# EAGLE design l6727a-5v (EAGLE 7.3.0)
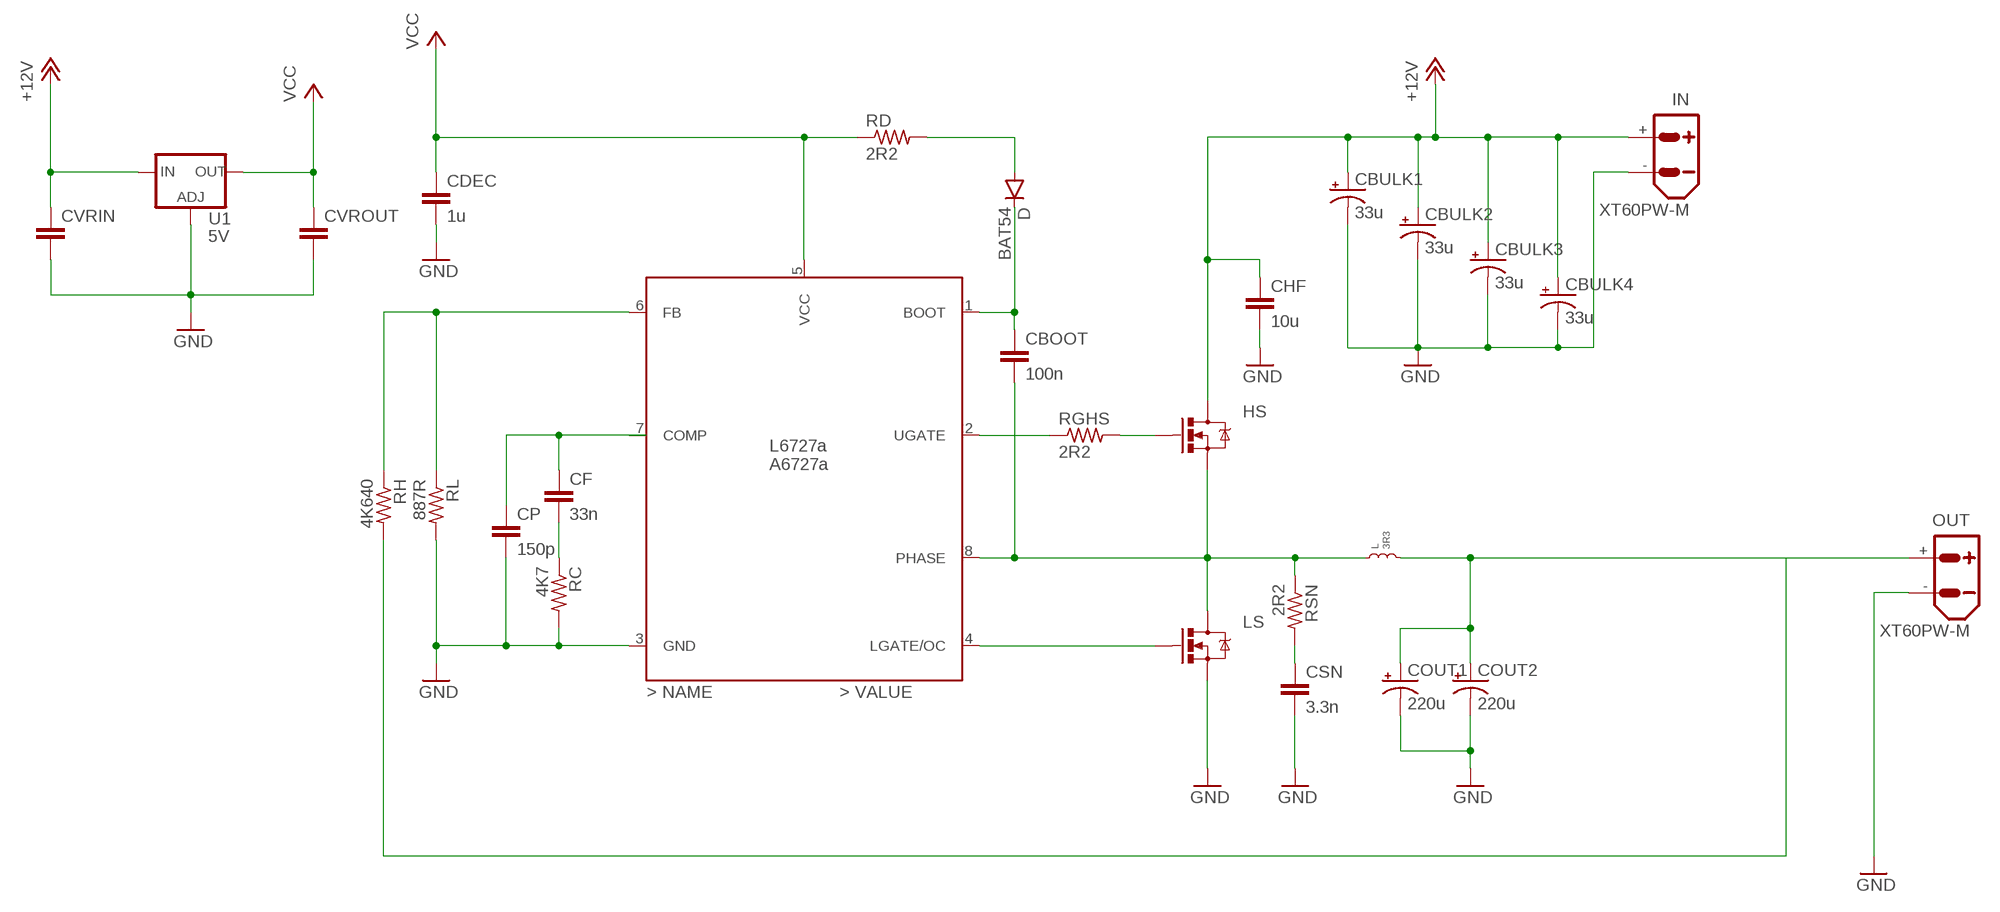
[diagram p0: schematic, sheet 1]

## Parts
CBOOT  100n  C-EUC0603  [C0603]
CBULK1  33u  CPOL-USSANYO_SMD_E7  [SANYO-OSCON_SMD_E7]
CBULK2  33u  CPOL-USSANYO_SMD_E7  [SANYO-OSCON_SMD_E7]
CBULK3  33u  CPOL-USSANYO_SMD_E7  [SANYO-OSCON_SMD_E7]
CBULK4  33u  CPOL-USSANYO_SMD_E7  [SANYO-OSCON_SMD_E7]
CDEC  1u  C-EUC0603  [C0603]
CF  33n  C-EUC0603  [C0603]
CHF  10u  C-EUC1206  [C1206]
COUT1  220u  CPOL-USSANYO_SMD_E7  [SANYO-OSCON_SMD_E7]
COUT2  220u  CPOL-USSANYO_SMD_E7  [SANYO-OSCON_SMD_E7]
CP  150p  C-EUC0603  [C0603]
CSN  3.3n  C-EUC0603  [C0603]
CVRIN  C-EUC1206  [C1206]
CVROUT  C-EUC1206  [C1206]
D  BAT54  DIODESOD123  [SOD-123]
HS  MOSFET-NCHANNELFDS6630A  [SO08]
IC1  L6727A  [SO-08]
IN  XT60PW-M  [XT60PW-M]
L  3R3  INDUCTOR.XAL1010  [XAL1010]
LS  MOSFET-NCHANNELFDS6630A  [SO08]
OUT  XT60PW-M  [XT60PW-M]
RC  4K7  R-US_R0603  [R0603]
RD  2R2  R-US_R0603  [R0603]
RGHS  2R2  R-US_R0603  [R0603]
RH  4K640  R-US_R0603  [R0603]
RL  887R  R-US_R0603  [R0603]
RSN  2R2  R-US_R0603  [R0603]
U1  5V  V_REG_317SMD  [SOT223]

## Nets
+12V: CBULK1.+ CBULK2.+ CBULK3.+ CBULK4.+ CHF.1 CVRIN.1 HS.5(D) HS.6(D) HS.7(D) HS.8(D) IN.+ U1.3(IN)
BOOT: CBOOT.1 D.C IC1.1(BOOT)
COMP: CF.1 CP.1
FB: IC1.6(FB) RH.1 RL.1
GND: CBULK1.- CBULK2.- CBULK3.- CBULK4.- CDEC.2 CHF.2 COUT1.- COUT2.- CP.2 CSN.2 CVRIN.2 CVROUT.2 IC1.3(GND) IN.- LS.1(S) LS.2(S) LS.3(S) OUT.- RC.2 RL.2 U1.1(ADJ)
LGATE: IC1.4(LGATE/OC) LS.4(G)
N$1: D.A RD.2
N$3: CF.2 RC.1
PHASE: CBOOT.2 HS.1(S) HS.2(S) HS.3(S) IC1.8(PHASE) L.P$1 LS.5(D) LS.6(D) LS.7(D) LS.8(D) RSN.1
RSN: CSN.1 RSN.2
UGATE: HS.4(G) RGHS.2
UGATE`: IC1.2(UGATE) RGHS.1
VCC: CDEC.1 CVROUT.1 IC1.5(VCC) RD.1 U1.2(OUT)
VOUT: COUT1.+ COUT2.+ L.P$2 OUT.+ RH.2
Unconnected: IC1.7(COMP)

## Library data of the parts
CBOOT CDEC CF CHF CP CSN CVRIN CVROUT = rcl:C-EU: CAPACITOR, European symbol
CBULK1-CBULK4 COUT1 COUT2 = rcl:CPOL-US: POLARIZED CAPACITOR, American symbol
D = SparkFun-DiscreteSemi:DIODE: Diode These are standard reverse protection diodes and small signal diodes. SMA package can handle up to about 1A. SOD-323 can handle about 200mA. What the SOD-323 package when ordering, there are some mfgs out there that are 5-pin packages.
HS LS = SparkFun-DiscreteSemi:MOSFET-NCHANNEL: Common NMOSFET Parts MFG P/N Store ID Prod ID FDD8780 TRANS-09984 SI7820DN TRANS-11055 FDS6630A IC-08089 2N7002PW TRANS-11151 FQP30N06L COM-10213 TRANS-10060 BSS123LT1G TRANS-08345 BSS138 TRANS-00830 BS170 2N7000; PROD_ID: IC-08089
IC1 = stm-l6727a:L6727A: L6726A is a single-phase step-down controller with integrated high-current drivers that provides complete control logic, protections and reference voltage to realize in an easy and simple way general DC-DC converters by using a compact SO-8 package. Device flexibility allows managing conversions with power input VIN as low as 1.5 V and device supply voltage ranging from 5 V to 12 V
IN OUT = amass:XT60: AMASS XT60 connector Store in Japan AMASS XT60 connector <https://szc.jp/ams-xt60>
L = coilcraft:INDUCTOR
RC RD RGHS RH RL RSN = rcl:R-US_: RESISTOR, American symbol
U1 = SparkFun-PowerIC:V_REG_317: Voltage Regulator Standard LM317 adjustable voltage regulator. AOI (Adjust Output Input). Google 'LM317 Calculator' for easy to use app to get the two resistor values needed. 240/720 for 5V output. 240/390 for 3.3V output. Spark Fun Electronics SKU : COM-00527

## Board
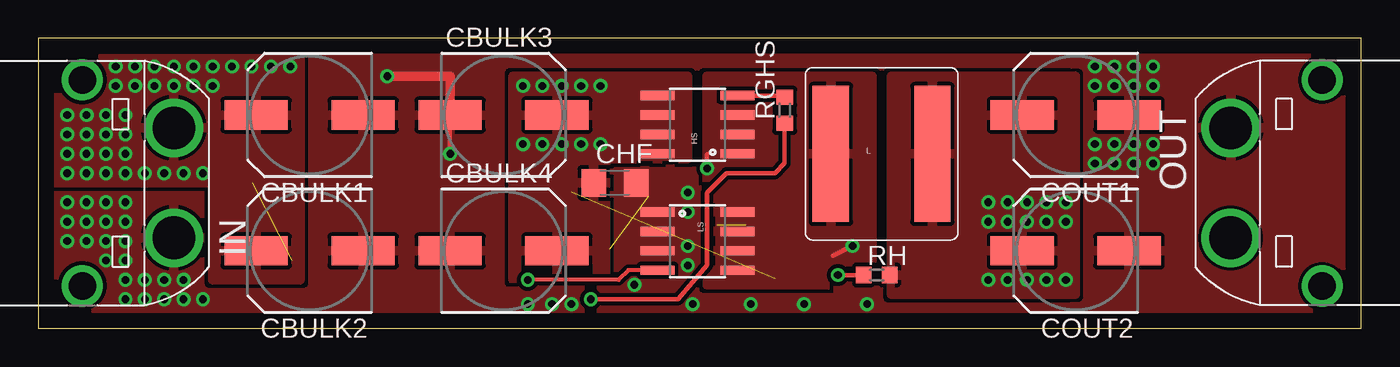
[diagram p1: board, top side]
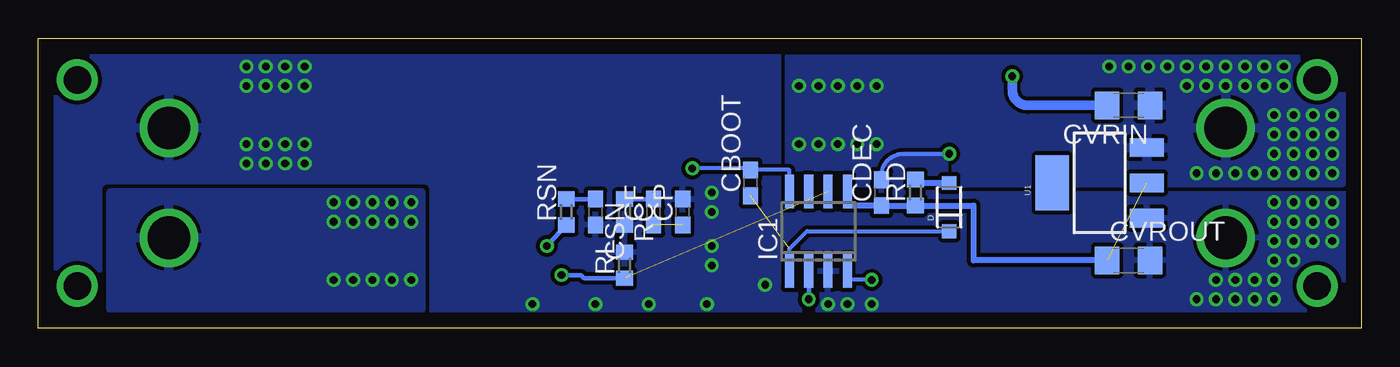
[diagram p2: board, bottom side, seen from below]

Size 86.67 x 19 mm. Coordinates in mm from the lower left corner, seen from the top.
Outline: 0,0 86.67,0 86.67,19 0,19 0,0
Copper layers (1*16): Top 0.035mm / dielectric 1.5mm / Bottom 0.035mm
Design rules "default": minimum track width 10mil, minimum drill 24mil, track to track 8mil, track to pad 8mil, pad to pad 8mil, via to via 8mil, smd to smd 8mil, copper to edge 40mil, drill to drill 8mil, minimum pad ring 10mil, minimum via ring 8mil, stop-mask expansion 4mil, vias tented up to drill 0mil, thermal gap 10mil

### Footprints (pad centres in the part's own frame; a part is rotated, then mirrored left to right if it is on the bottom)
C0603 = smd 1.1 x 1: 1 -0.85,0; 2 0.85,0
SANYO-OSCON_SMD_E7 = smd 4.15 x 1.9: + 3.5,0; - -3.5,0
C1206 = smd 1.6 x 1.8: 1 -1.4,0; 2 1.4,0
SOD-123 = smd 0.9 x 0.95: A 1.575,0; C -1.575,0
SO08 = smd 0.61 x 2.21: 1 -1.905,-2.616; 2 -0.635,-2.616; 3 0.635,-2.616; 4 1.905,-2.616; 5 1.905,2.616; 6 0.635,2.616; 7 -0.635,2.616; 8 -1.905,2.616
SO-08 = smd 0.6 x 2.2: 1 -1.905,-2.6; 2 -0.635,-2.6; 3 0.635,-2.6; 4 1.905,-2.6; 5 1.905,2.6; 6 0.635,2.6; 7 -0.635,2.6; 8 -1.905,2.6
XT60PW-M = drill 2.8: + 3.6,0; - -3.6,0 | drill 1.8: P$3 -6.75,6; P$4 6.75,6
XAL1010 = smd 2.38 x 8.91: P$1 -3.325,0; P$2 3.325,0
R0603 = smd 1 x 1.1: 1 -0.85,0; 2 0.85,0
SOT223 = smd 1.219 x 2.235: 1 -2.311,-3.099; 2 0,-3.099; 3 2.311,-3.099 | smd 3.6 x 2.2: 4 0,3.099

### Placement (x,y rotation side)
CBOOT  40.01,9.53 90 bottom
CBULK1  17.78,13.97 180 top
CBULK2  17.78,5.08 180 top
CBULK3  30.48,13.97 0 top
CBULK4  30.48,5.08 0 top
CDEC  31.43,8.89 90 bottom
CF  46.35,7.62 90 bottom
CHF  37.78,9.53 0 top
COUT1  67.94,13.97 180 top
COUT2  67.94,5.08 180 top
CP  44.45,7.62 90 bottom
CSN  50.16,7.62 270 bottom
CVRIN  15.24,14.61 180 bottom
CVROUT  15.24,4.45 0 bottom
D  26.99,7.94 90 bottom
HS  43.18,13.34 90 top
IC1  35.56,6.35 0 bottom
IN  8.89,9.53 90 top
L  55.24,11.43 0 top
LS  43.18,5.71 270 top
OUT  78.11,9.53 270 top
RC  48.26,7.62 270 bottom
RD  29.21,8.89 90 bottom
RGHS  48.9,14.29 90 top
RH  54.93,3.49 0 top
RL  48.26,4.13 90 bottom
RSN  52.07,7.62 90 bottom
U1  17.14,9.53 90 bottom

### Tracks (layer width: path | path; a pad name or v marks a point on that pad's centre or on a via)
+12V  (via drill 0.5)
  other vias: 31.75,12.06 33.02,12.06 34.29,12.06 35.56,12.06 36.83,12.06 31.75,15.88 33.02,15.88 34.29,15.88 35.56,15.88 36.83,15.88 16.51,17.14 15.24,17.14 13.97,17.14 12.7,17.14 11.43,17.14 10.16,17.14 8.89,17.14 7.62,17.14 6.35,17.14 5.08,17.14 5.08,15.88 6.35,15.88 7.62,15.88 8.89,15.88 10.16,15.88 11.43,15.88 1.91,13.97 3.17,13.97 4.45,13.97 5.71,13.97 5.71,12.7 4.45,12.7 3.17,12.7 1.91,12.7 1.91,11.43 1.91,10.16 3.17,10.16 4.45,10.16 5.71,10.16 5.71,11.43 4.45,11.43 3.17,11.43 6.99,10.16 8.26,10.16 9.53,10.16 10.79,10.16
  pour Top (isolate 0.254, rank 4): 0.64,17.78 17.14,17.78 17.14,3.17 11.43,3.17 11.43,9.53 0.64,9.53
  pour Top (isolate 0.254, rank 4): 31.11,16.51 37.15,16.51 37.15,3.17 31.11,3.17
  pour Bottom (isolate 0.254, rank 4): 1.27,17.78 37.47,17.78 37.47,9.53 1.27,9.53
  pour Top (isolate 0.254, rank 4): 31.11,16.51 42.55,16.51 42.55,11.11 37.15,11.11 37.15,10.16 31.11,10.16
  pour Top (isolate 0.254, rank 5, no thermals): 38.73,15.88 38.73,11.11 42.55,11.11 42.55,15.88
BOOT  (1 unrouted)
  Bottom 0.254: IC1.1 37.47,5.21 36.31,6.36 D.C
COMP  (1 unrouted)
FB  (via drill 0.5)  (1 unrouted)
  Top 0.305: RH.1 v52.39,3.49
  Bottom 0.305: v52.39,3.49 51.12,3.49 50.9,3.28 RL.1
GND  (via drill 0.5)
  Top 0.254: v26.99,11.43 CBULK3.-
  Top 0.61: v22.86,16.51 26.98,16.51 CBULK3.-
  Bottom 0.254: CDEC.2 31.43,10.01 arc90 30.01,11.43 v26.99,11.43
  Bottom 0.61: CVRIN.2 21.86,14.61 arc90 22.86,15.61 v22.86,16.51
  other vias: 69.22,17.14 69.22,15.88 69.22,12.06 69.22,10.79 70.48,10.79 71.75,10.79 73.03,10.79 73.03,12.06 71.75,12.06 70.48,12.06 70.48,15.88 70.48,17.14 71.75,17.14 71.75,15.88 73.03,15.88 73.03,17.14 1.91,8.26 1.91,6.99 1.91,5.71 3.17,5.71 3.17,6.99 3.17,8.26 4.45,8.26 4.45,6.99 4.45,5.71 4.45,4.45 5.71,5.71 5.71,6.99 5.71,8.26 5.71,4.45 5.71,3.17 5.71,1.91 6.99,1.91 6.99,3.17 8.26,3.17 8.26,1.91 9.53,1.91 9.53,3.17 10.79,1.91 32.07,1.59 33.66,1.59 34.92,1.59 39.05,2.86 42.86,1.59 46.67,1.59 50.16,1.59 54.29,1.59 42.55,8.89 42.55,7.62 42.55,5.4 42.55,4.13
  pour Top (rank 5): 67.94,17.78 85.72,17.78 85.72,1.27 67.94,1.27
  pour Bottom (rank 5): 61.59,17.78 81.92,17.78 81.92,10.16 61.59,10.16
  pour Top (isolate 0.254, rank 5): 0,0 30.48,0 30.48,19.05 17.78,19.05 17.78,8.89 0,8.89
  pour Bottom (isolate 0.254, rank 6): 0,19.05 87,19.05 87,0 0,0
  pour Top (isolate 0.254, rank 6): 0,19.05 87,19.05 87,0 0,0
  pour Top (isolate 0.254, rank 5, no thermals): 38.1,10.48 38.1,2.22 43.18,2.22 43.18,10.48
LGATE  (via drill 0.5)
  Top 0.254: v32.07,3.17 38.02,3.17 38.66,3.81 LS.4
  Bottom 0.254: v32.07,3.17 33.66,3.17 IC1.4
N$1
  Bottom 0.406: D.A 29.21,9.51 RD.2
N$3
  Bottom 0.305: CF.2 RC.1
PHASE  (via drill 0.5)
  Top 0.254: v43.81,10.48 43.81,11.43
  Top 0.305: v53.34,5.4 52.07,4.76
  Bottom 0.254: IC1.8 37.47,10.38 CBOOT.2 40.01,10.48 v43.81,10.48
  Bottom 0.305: RSN.1 v53.34,5.4
  pour Top (isolate 0.254, rank 4): 43.81,16.51 54.61,16.51 54.61,2.86 43.81,2.86
  pour Top (isolate 0.254, rank 5, no thermals): 43.81,14.61 43.81,10.48 47.94,10.48 47.94,14.61
  pour Top (isolate 0.254, rank 5, no thermals): 44.45,8.57 44.45,2.86 47.62,2.86 47.62,8.57
RSN
  Bottom 0.305: CSN.1 RSN.2
UGATE
  Top 0.305: HS.4 48.9,15.24
  Top 0.406: 48.9,15.24 RGHS.2
UGATE`  (via drill 0.5)
  Top 0.305: RGHS.1 48.9,10.79 48.26,10.16 45.09,10.16 43.81,8.89 43.81,4.13 41.91,1.91 v36.2,1.91
  Bottom 0.305: v36.2,1.91 IC1.2
VCC  (1 unrouted)
  Bottom 0.406: CVROUT.1 25.4,4.45 25.4,8.04 RD.1 CDEC.1 33.66,8.04 IC1.5
VOUT  (via drill 0.5)
  other vias: 67.31,3.17 66.04,3.17 64.77,3.17 63.5,3.17 62.23,3.17 62.23,8.26 63.5,8.26 64.77,8.26 66.04,8.26 67.31,8.26 67.31,6.99 66.04,6.99 64.77,6.99 63.5,6.99 62.23,6.99
  pour Top (rank 4): 55.88,16.51 67.94,16.51 67.94,2.22 55.88,2.22
  pour Bottom (rank 4): 61.59,8.89 81.92,8.89 81.92,1.27 61.59,1.27